# Altium schematic sheet audioAmp.SchDoc
size A4; Organization: Altium Limited; Address1: L3, 12a Rodborough Rd; Address2: Frenchs Forest; Address3: NSW; Address4: Australia 2086; DocumentNumber: 5; SheetNumber: 5; SheetTotal: 5
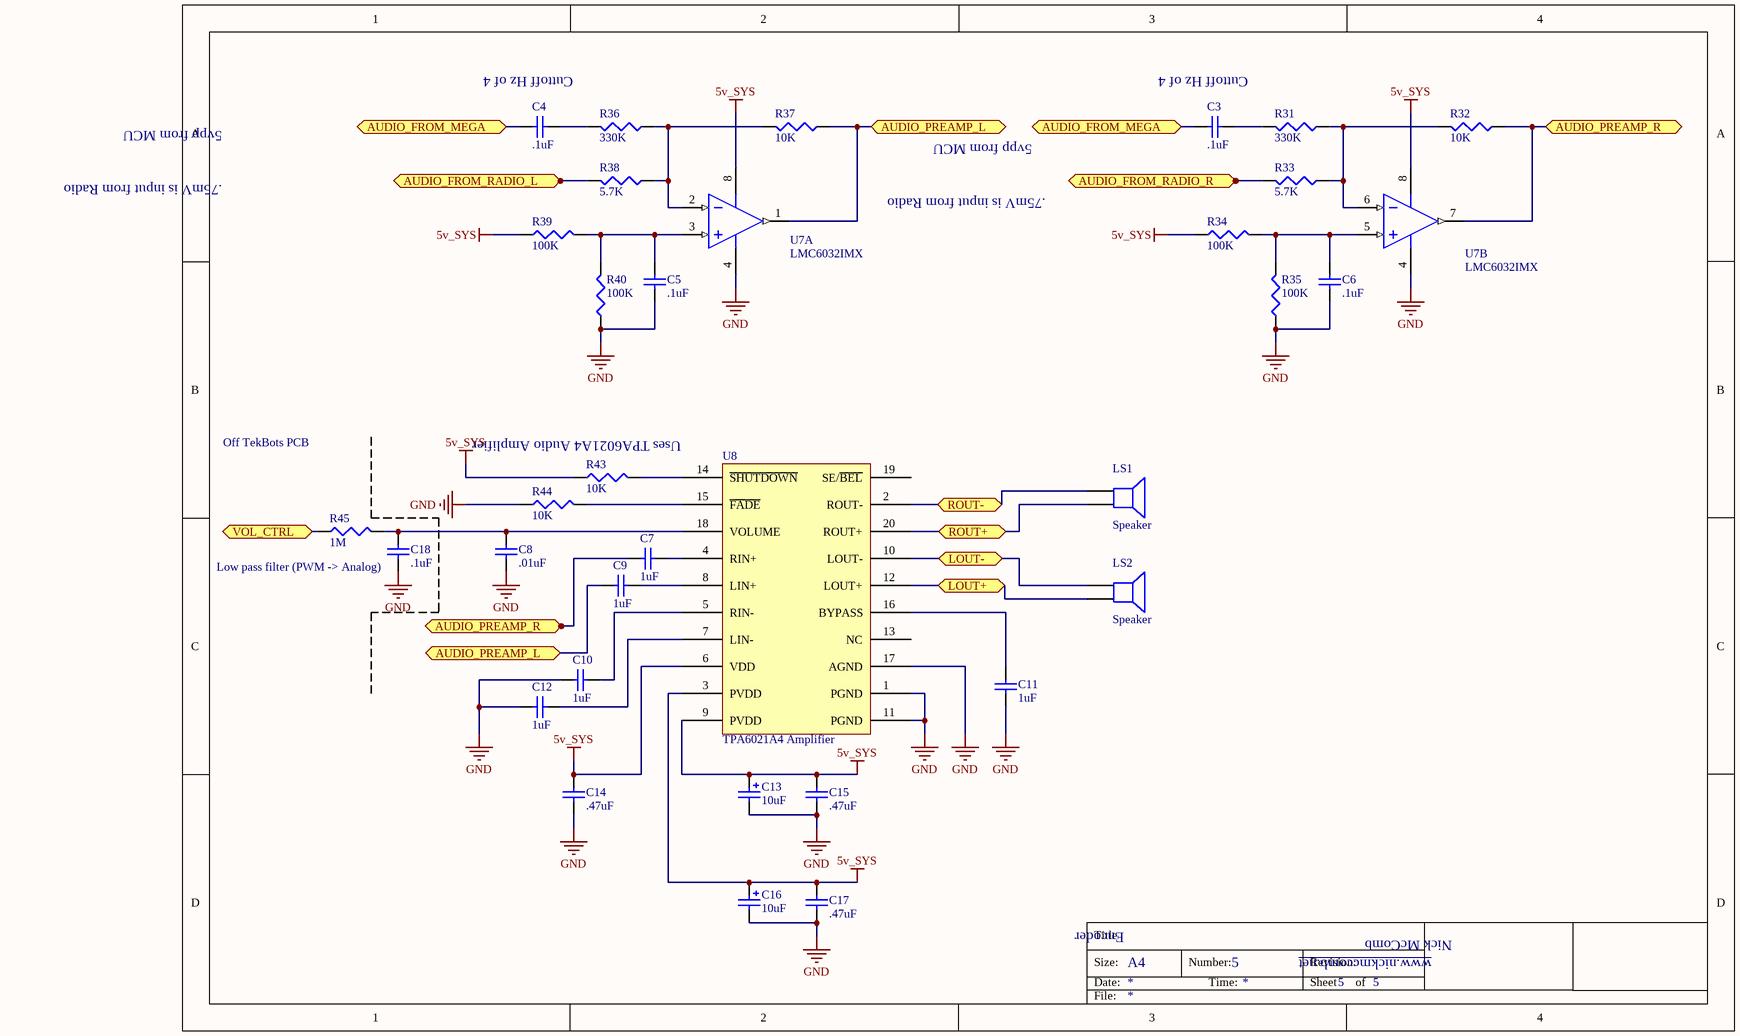
[diagram p0: audioAmp.SchDoc]

## Parts
C3  value .1uF  [C0805]  (hidden comment: 0805 style, by default)
C4  value .1uF  [C0805]  (hidden comment: 0805 style, by default)
C5  value .1uF  [C0805]  (hidden comment: 0805 style, by default)
C6  value .1uF  [C0805]  (hidden comment: 0805 style, by default)
C7  value 1uF  [C0805]  (hidden comment: 0805 style, by default)
C8  value .01uF  [C0805]  (hidden comment: 0805 style, by default)
C9  value 1uF  [C0805]  (hidden comment: 0805 style, by default)
C10  value 1uF  [C0805]  (hidden comment: 0805 style, by default)
C11  value 1uF  [C0805]  (hidden comment: 0805 style, by default)
C12  value 1uF  [C0805]  (hidden comment: 0805 style, by default)
C13  10uF
C14  value .47uF  [C0805]  (hidden comment: 0805 style, by default)
C15  value .47uF  [C0805]  (hidden comment: 0805 style, by default)
C16  10uF
C17  value .47uF  [C0805]  (hidden comment: 0805 style, by default)
C18  value .1uF  [C0805]  (hidden comment: 0805 style, by default)
LS1  Speaker  [PIN2]
LS2  Speaker  [PIN2]
R31  330K  [J1-0603]
R32  10K  [J1-0603]
R33  5.7K  [J1-0603]
R34  100K  [J1-0603]
R35  100K  [J1-0603]
R36  330K  [J1-0603]
R37  10K  [J1-0603]
R38  5.7K  [J1-0603]
R39  100K  [J1-0603]
R40  100K  [J1-0603]
R43  10K  [J1-0603]
R44  10K  [J1-0603]
R45  1M  [J1-0603]
U7  LMC6032IMX  [D0008A_M]  (parts A,B of 2)
U8  TPA6021A4 Amplifier

## Ports
AUDIO_FROM_MEGA, AUDIO_FROM_RADIO_L, AUDIO_FROM_RADIO_R, AUDIO_PREAMP_L, AUDIO_PREAMP_R, LOUT+, LOUT-, ROUT+, ROUT-, VOL_CTRL

## Nets
5v_SYS: C13.1 C14.2 C15.2 C16.1 C17.2 R34.1 R39.1 R43.1 U7.8(V+) U8.3(PVDD) U8.6(VDD) U8.9(PVDD)
GND: C5.1 C6.1 C8.1 C10.1 C11.1 C12.1 C13.2 C14.1 C15.1 C16.2 C17.1 C18.1 R35.1 R40.1 R44.1 U7.4(V-) U8.1(PGND) U8.11(PGND) U8.17(AGND)
AUDIO_FROM_MEGA: C3.1 C4.1 ; port AUDIO_FROM_MEGA
AUDIO_FROM_RADIO_L: R38.2 ; port AUDIO_FROM_RADIO_L
AUDIO_FROM_RADIO_R: R33.2 ; port AUDIO_FROM_RADIO_R
AUDIO_PREAMP_L: C9.1 R37.1 U7.1(OUTA) ; port AUDIO_PREAMP_L
AUDIO_PREAMP_R: C7.1 R32.1 U7.7(OUTB) ; port AUDIO_PREAMP_R
LOUT+: LS2.2 U8.12(LOUT+) ; port LOUT+
LOUT-: LS2.1 U8.10(LOUT-) ; port LOUT-
ROUT+: LS1.2 U8.20(ROUT+) ; port ROUT+
ROUT-: LS1.1 U8.2(ROUT-) ; port ROUT-
VOL_CTRL: R45.1 ; port VOL_CTRL
NetC3_2: C3.2 R31.2
NetC4_2: C4.2 R36.2
NetC5_2: C5.2 R39.2 R40.2 U7.3(INA+)
NetC6_2: C6.2 R34.2 R35.2 U7.5(INB+)
NetC7_2: C7.2 U8.4(RIN+)
NetC8_2: C8.2 C18.2 R45.2 U8.18(VOLUME)
NetC9_2: C9.2 U8.8(LIN+)
NetC10_2: C10.2 U8.5(RIN-)
NetC11_2: C11.2 U8.16(BYPASS)
NetC12_2: C12.2 U8.7(LIN-)
NetR31_1: R31.1 R32.2 R33.1 U7.6(INB-)
NetR36_1: R36.1 R37.2 R38.1 U7.2(INA-)
NetR43_2: R43.2 U8.14(~{SHUTDOWN})
NetR44_2: R44.2 U8.15(~{FADE})

Not connected (* = marked no-connect by the designer): U8 13(NC) 19(SE/~{BEL})

## Notes on the sheet
- Cuttoff Hz of 4
- .75mV is input from Radio
- 5vpp from MCU
- (near R34) .75mV is input from Radio
- Off TekBots PCB
- (near U8) Uses TPA6021A4 Audio Amplifier
- (near C18) Low pass filter (PWM -> Analog)
- Encoder
- Title
- Size:
- Date:
- A4
- Number:
- Time:
- Revision:
- Sheet
- of
- www.nickmccomb.net
- Nick McComb
- File:

## Library data of the parts
C3-C12 C14 C15 C17 C18 = Cap: Capacitor; Published: 8-Jun-2000; LatestRevisionDate: 17-Jul-2002; LatestRevisionNote: Re-released for DXP Platform.; PackageReference: RAD-0.3; Publisher: Altium Limited; PackageDescription: Radial Cap, Thru-Hole; 2 Leads; 0.3 in Pin Spacing
C13 C16 = Cap Pol: Polarized Capacitor (Radial); Value: 10uF
LS1 LS2 = Speaker: Loudspeaker; Published: 24-Mar-1999; LatestRevisionDate: 17-Jul-2002; LatestRevisionNote: Re-released for DXP Platform.; PackageReference: PIN2; Publisher: Altium Limited
R31-R40 R43-R45 = Res3: Resistor; Published: 8-Jun-2000; LatestRevisionDate: 29-May-2009; LatestRevisionNote: IPC-7351 Footprint Added.; PackageReference: J1-0603; Publisher: Altium Limited; PackageDescription: Chip Resistor
  R31 R36: Value: 330K
  R32 R37 R43 R44: Value: 10K
  R33 R38: Value: 5.7K
  R34 R35 R39 R40: Value: 100K
  R45: Value: 1M
U7 = CMP-0055-00692-3: CMOS Dual Operational Amplifier, 8-pin Narrow SOIC; Manufacturer: Texas Instruments; PowerWise: N; PackageTopMarking: NSZXTT*LMC60*32IM; CompType: Amplifiers; PinCount: 8; ComponentLink1URL: http://www.ti.com/general/docs/lit/getliterature.tsp?genericPartNumber=LMC6032&fileType=pdf; Package Reference: D0008A; Code_JEDEC: MS-012-AA; Code_IPC: SOIC127P600-8; ComponentLink1Description: Datasheet URL; PackageDescription: SOIC Narrow, 4.9 x 3.9 x 1.45mm, 8 Lead, 1.27mm Pitch; RoHS: N; PartId: 1
U8 = TPA6021A4 Amplifier: Audio Amplifier